# Altium project 2_order_filter_without_OPA.PrjPcb
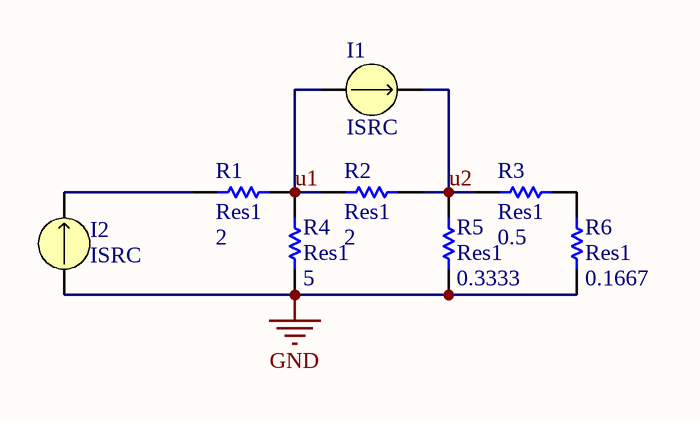
[diagram p0: Sheet2.SchDoc]
1 sheet, 8 parts. Net scope: global (net labels, ports and power ports of the same name join across sheets).

## Sheet Sheet2.SchDoc
size A4

### Parts
I1  ISRC
I2  ISRC
R1  Res1  value 2  [AXIAL-0.3]
R2  Res1  value 2  [AXIAL-0.3]
R3  Res1  value 0.5  [AXIAL-0.3]
R4  Res1  value 5  [AXIAL-0.3]
R5  Res1  value 0.3333  [AXIAL-0.3]
R6  Res1  value 0.1667  [AXIAL-0.3]

### Nets
GND: I2.1 R4.1 R5.1 R6.1
u1: I1.1 R1.2 R2.1 R4.2
u2: I1.2 R2.2 R3.1 R5.2
NetI2_2: I2.2 R1.1
NetR3_2: R3.2 R6.2

### Library data of the parts
I1 = ISRC: Current Source; Note: PCB Footprint - Not required; Value: 10; Published: 8-Jun-2000; LatestRevisionDate: 17-Jul-2002; LatestRevisionNote: Re-released for DXP Platform.; PackageReference: Not Applicable; Publisher: Altium Limited
I2 = ISRC: Current Source; Note: PCB Footprint - Not required; Value: 4; Published: 8-Jun-2000; LatestRevisionDate: 17-Jul-2002; LatestRevisionNote: Re-released for DXP Platform.; PackageReference: Not Applicable; Publisher: Altium Limited
R1-R6 = Res1: Resistor; Published: 8-Jun-2000; LatestRevisionDate: 17-Jul-2002; LatestRevisionNote: Re-released for DXP Platform.; PackageReference: AXIAL-0.3; Publisher: Altium Limited; PackageDescription: Axial Device, Thru-Hole; 2 Leads; 0.3 in Pin Spacing